# EasyEDA Pro project Led strip project Schematic &PCB.eprj, board PCB8
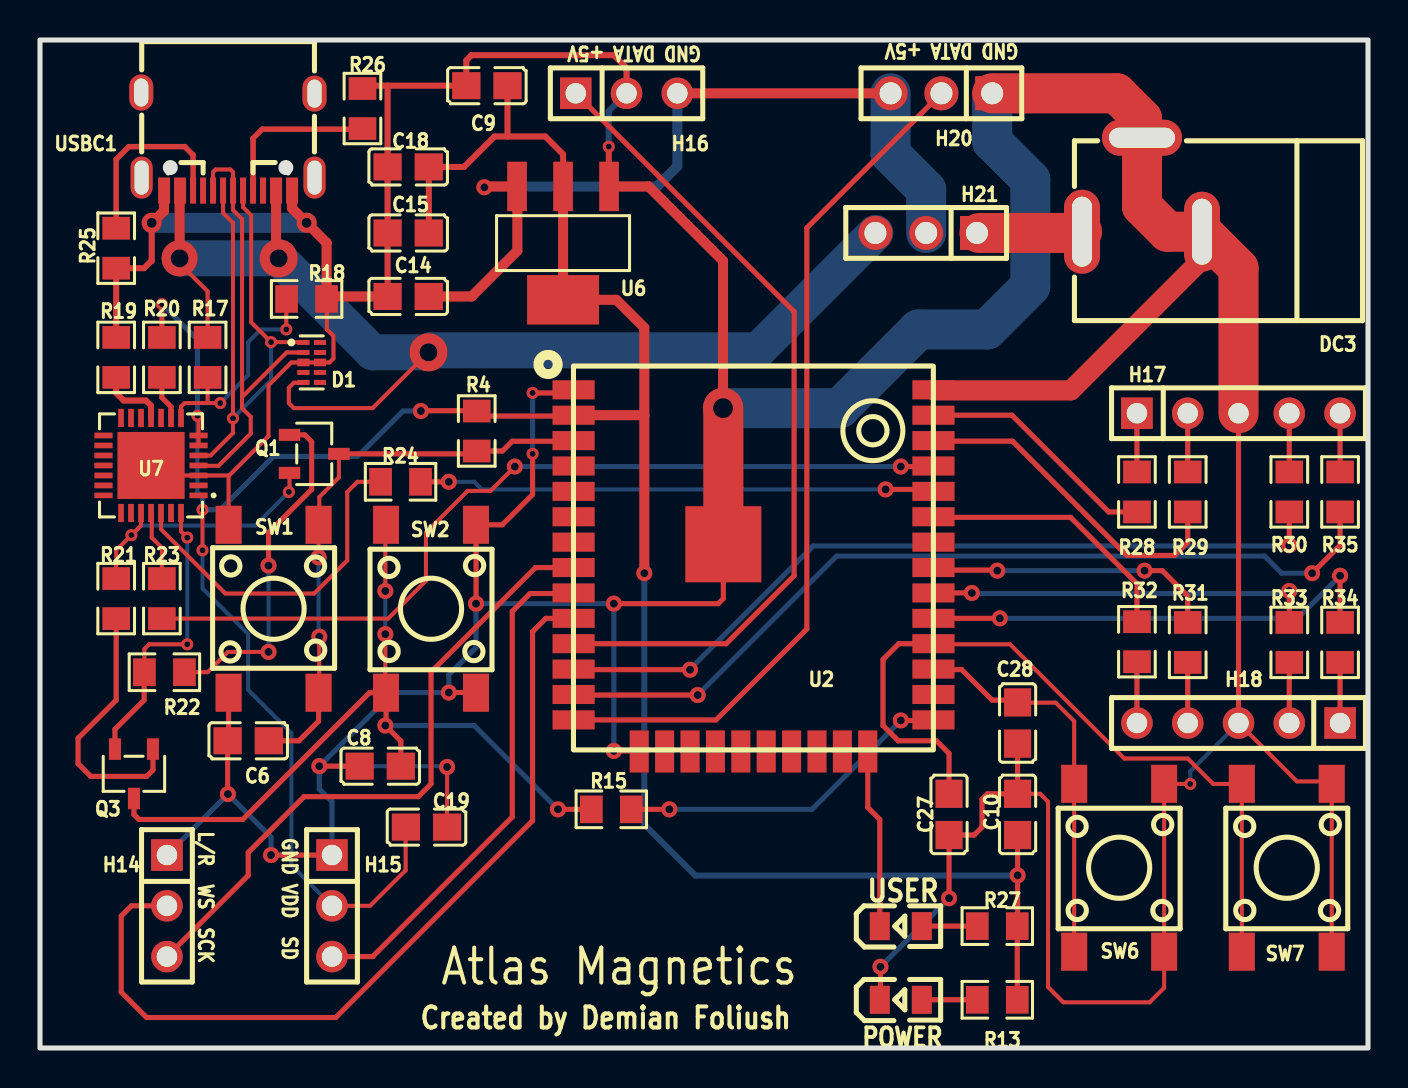
[diagram p4: board, top side]
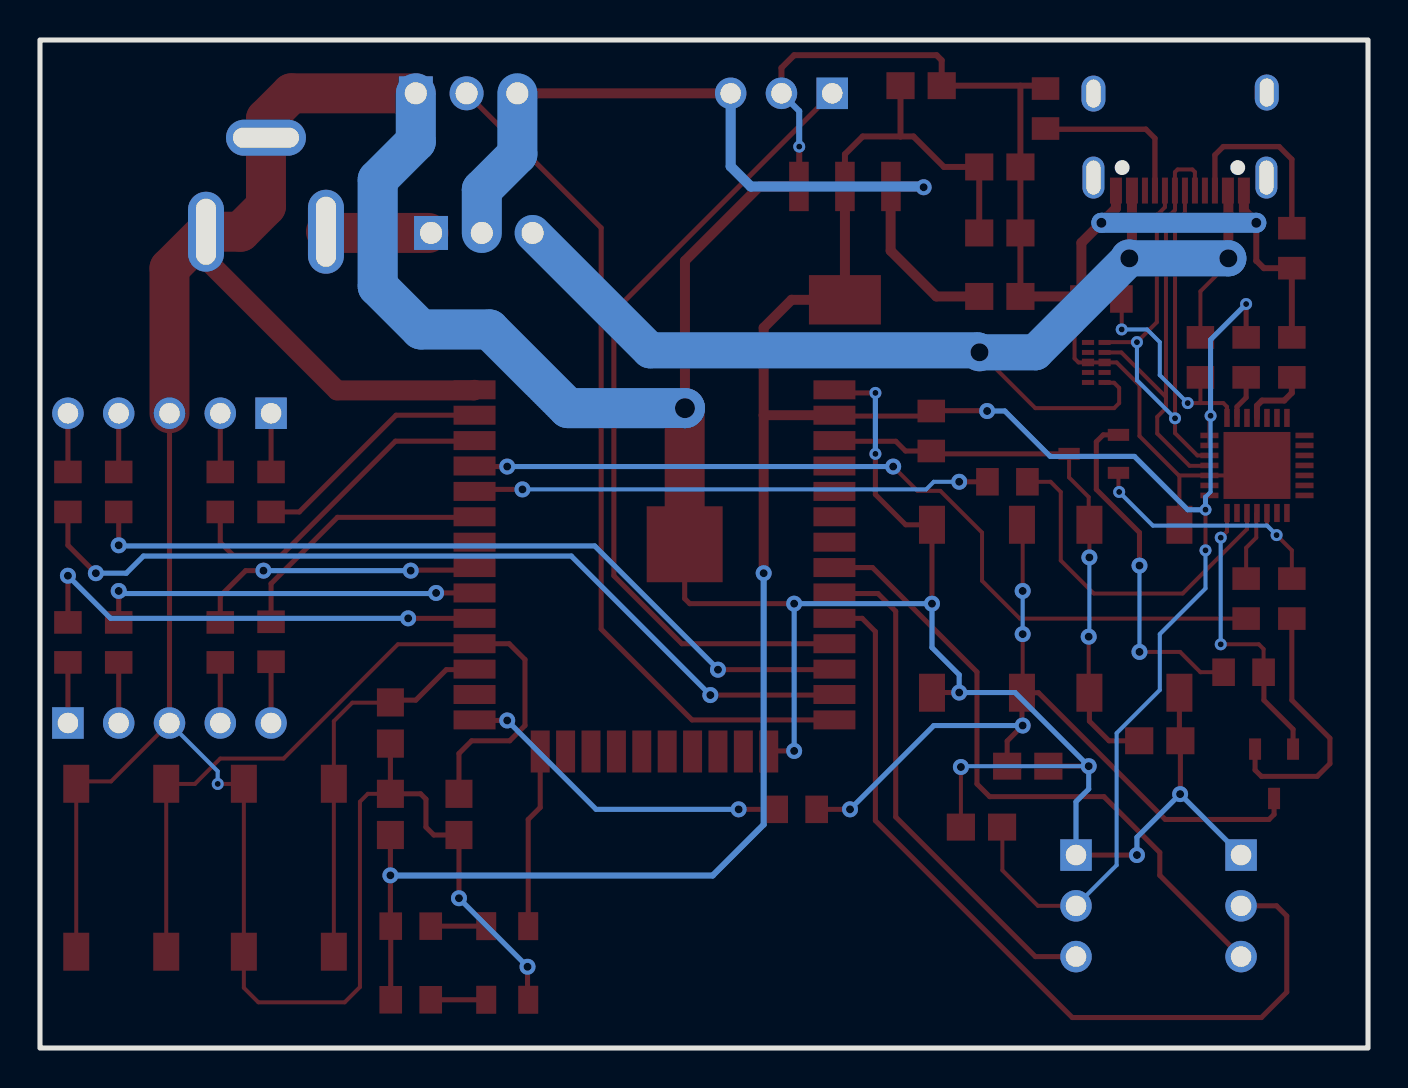
[diagram p5: board, bottom side, seen from below]

Outline 66.42 x 50.42 mm; copper layers: Top Layer, Bottom Layer. Coordinates in mm from the lower left corner of the outline.
Outline path: rectangle 0,50.42 66.42,0
Stack: Top Layer 0.035mm / Dielectric1 1.51mm FR4 er 4.5 / Bottom Layer 0.035mm

## Design rules (mm)
template: Custom Config
spacing copperThickness1oz (default): track to track 0.254, other pairs 0.124 to 0.3
spacing copperThickness2oz: track to track 0.203, other pairs 0.152 to 0.3
track width copperThickness1oz (default): min 0.127, default 0.254, max 2.54
track width copperThickness2oz: min 0.203, default 0.254, max 2.54
differential pair differentialPair (default): width min 0.127, default 0.254, max 2.54; gap min 0.152, default 0.152
via viaSize (default): diameter min 0.5, default 0.61, max 10; hole min 0.3, default 0.305, max 6.299

## Placement (name value [footprint] x y rotation side)
C6  1000nF  [C0805]  10.41 15.37 0 top
C8  100nF  [C0805]  17.02 14.1 0 top
C9  100nF  [C0805]  22.35 48.13 180 top
C10  22uF  [C0805]  48.89 11.68 270 top
C14  10uF  [C0805]  18.42 37.59 0 top
C15  10uF  [C0805]  18.42 40.77 0 top
C18  4.7uF  [C0805]  18.42 44.07 0 top
C19  100nF  [C0805]  19.33 11.05 180 top
C27  100nF  [C0805]  45.47 11.68 90 top
C28  100nF  [C0805]  48.89 16.26 90 top
D1  TPD4E02B04DQAR  [USON-10_L2.5-W1.0-P0.50-BL]  13.59 34.29 270 top
DC3  DC-005-5A-2.5  [DC-IN-TH_DC-005-5A-2.5]  55.12 43.18 180 top
H14  -  [HDR-TH_3P-P2.54-V-F]  6.35 7.11 270 top
H15  -  [HDR-TH_3P-P2.54-V-F]  14.61 7.11 270 top
H16  -  [HDR-TH_3P-P2.54-V-F]  29.34 47.75 0 top
H17  -  [HDR-TH_5P-P2.54-V-F]  59.94 31.75 0 top
H18  -  [HDR-TH_5P-P2.54-V-F]  59.94 16.26 180 top
H20  X6511WV-03H-C30D60  [HDR-TH_3P-P2.54-V-M]  45.08 47.75 180 top
H21  X6511WV-03H-C30D60  [HDR-TH_3P-P2.54-V-M]  44.32 40.77 180 top
LED3  NCD0805B2  [LED0805-R-RD]  43.05 6.1 0 top
LED6  NCD0805G1  [LED0805-R-RD]  43.05 2.41 0 top
Q1  SS8050-G  [SOT-23-3_L2.9-W1.6-P1.90-LS2.8-BR]  13.72 29.72 180 top
Q3  SS8050-G  [SOT-23-3_L2.9-W1.6-P1.90-LS2.8-BR]  4.7 13.72 90 top
R4  10kΩ  [R0805]  21.84 30.86 270 top
R13  47Ω  [R0805]  47.88 2.41 0 top
R15  22Ω  [R0805]  28.58 11.94 0 top
R17  22kΩ  [R0805]  8.38 34.54 90 top
R18  47kΩ  [R0805]  13.34 37.46 180 top
R19  10kΩ  [R0805]  3.81 34.54 270 top
R20  1kΩ  [R0805]  6.1 34.54 270 top
R21  10kΩ  [R0805]  3.81 22.48 90 top
R22  10kΩ  [R0805]  6.22 18.8 180 top
R23  0Ω  [R0805]  6.1 22.48 270 top
R24  0Ω  [R0805]  18.03 28.32 0 top
R25  5.1kΩ  [R0805]  3.81 40 270 top
R26  5.1kΩ  [R0805]  16.13 46.99 270 top
R27  47Ω  [R0805]  47.88 6.1 0 top
R28  150Ω  [R0805]  54.86 27.81 270 top
R29  150Ω  [R0805]  57.4 27.81 270 top
R30  150Ω  [R0805]  62.48 27.81 270 top
R31  150Ω  [R0805]  57.4 20.29 270 top
R32  150Ω  [R0805]  54.86 20.32 90 top
R33  150Ω  [R0805]  62.48 20.29 270 top
R34  150Ω  [R0805]  65.02 20.29 270 top
R35  150Ω  [R0805]  65.02 27.81 270 top
SW1  PTS645SH50SMTR92LFS  [KEY-SMD_4P-L6.0-W6.0-P4.50-LS9.0]  11.68 21.97 270 top
SW2  PTS645SH50SMTR92LFS  [KEY-SMD_4P-L6.0-W6.0-P4.50-LS9.0]  19.56 21.97 90 top
SW6  PTS645SH50SMTR92LFS  [KEY-SMD_4P-L6.0-W6.0-P4.50-LS9.0]  53.98 9.02 90 top
SW7  PTS645SH50SMTR92LFS  [KEY-SMD_4P-L6.0-W6.0-P4.50-LS9.0]  62.36 9.02 90 top
U2  ESP32-WROOM-32U-N4  [WIFIM-SMD_38P-L19.2-W18.0-P1.27]  35.69 23.88 90 top
U6  AMS1117-3.3  [SOT-223-4_L6.5-W3.5-P2.30-LS7.0-BR]  26.16 40.26 90 top
U7  CP2102N-A02-GQFN28R  [QFN-28_L5.0-W5.0-P0.50-TL-EP3.3]  5.55 29.14 180 top
USBC1  918-418K2023S40001  [USB-C-SMD_TYPE-C-USB-17]  9.4 45.34 180 top

## Footprints (pads in the part's own frame, mm; a bottom-side part is the same pattern mirrored in y, then rotated)
C0805
  rect 1.41x1.35 smd: 1(-1.03,0) 2(1.03,0)
DC-IN-TH_DC-005-5A-2.5
  oval 1.8x4.2 hole 1x3.5: 1(3,2.352)
  oval 1.8x4 hole 1x3.3: 2(-3,2.352)
  oval 4x1.8 hole 3.3x1: 3(-0.001,-2.352)
HDR-TH_3P-P2.54-V-F
  rect 1.575x1.575 hole 1.02: 1(-2.54,0)
  round 1.575 hole 1.02: 2(0,0) 3(2.54,0)
HDR-TH_3P-P2.54-V-M
  rect 1.7x1.7 hole 1.1: 1(-2.54,0)
  round 1.7 hole 1.1: 2(0,0) 3(2.54,0)
HDR-TH_5P-P2.54-V-F
  rect 1.575x1.575 hole 1.02: 1(-5.08,0)
  round 1.575 hole 1.02: 2(-2.54,0) 3(0,0) 4(2.54,0) 5(5.08,0)
KEY-SMD_4P-L6.0-W6.0-P4.50-LS9.0
  rect 1.9x1.3 smd: 1(-4.2,2.25) 2(4.2,2.25) 3(-4.2,-2.25) 4(4.2,-2.25)
LED0805-R-RD
  rect 1x1.399 smd: 1(1.05,0) 2(-1.05,0)
QFN-28_L5.0-W5.0-P0.50-TL-EP3.3
  rect 0.905x0.28 smd: 1(-2.377,1.5) 2(-2.377,1) 3(-2.377,0.5) 4(-2.377,0) 5(-2.377,-0.5) 6(-2.377,-1) 7(-2.377,-1.5) 15(2.377,-1.5) 16(2.377,-1) 17(2.377,-0.5) 18(2.377,0) 19(2.377,0.5) 20(2.377,1) 21(2.377,1.5)
  rect 0.28x0.905 smd: 8(-1.5,-2.377) 9(-1,-2.377) 10(-0.5,-2.377) 11(0,-2.377) 12(0.5,-2.377) 13(1,-2.377) 14(1.5,-2.377) 22(1.5,2.377) 23(1,2.377) 24(0.5,2.377) 25(0,2.377) 26(-0.5,2.377) 27(-1,2.377) 28(-1.5,2.377)
  rect 3.35x3.35 smd: 29(0,0)
R0805
  rect 1.133x1.377 smd: 1(-1,0) 2(1,0)
SOT-23-3_L2.9-W1.6-P1.90-LS2.8-BR
  rect 1.07x0.6 smd: 1(1.235,-0.95) 2(1.235,0.95) 3(-1.235,0)
SOT-223-4_L6.5-W3.5-P2.30-LS7.0-BR
  rect 2.47x0.98 smd: 1(2.835,-2.3) 2(2.835,0) 3(2.835,2.3)
  rect 2.47x3.6 smd: 4(-2.835,0)
USB-C-SMD_TYPE-C-USB-17
  oval 1.1x2.1 hole 0.7x1.7: 0(-4.334,1.802) 0(4.316,1.802)
  oval 1.2x1.8 hole 0.7x1.4: 0(-4.334,-2.398) 0(4.334,-2.453)
  rect 0.6x1.3 smd: A1(-3.209,2.451) A4(-2.409,2.451) A9(2.391,2.452) A12(3.191,2.451)
  rect 0.3x1.3 smd: A5(-1.259,2.451) A6(-0.259,2.451) A7(0.241,2.451) A8(1.24,2.453) B5(1.741,2.451) B6(0.741,2.451) B7(-0.759,2.451) B8(-1.759,2.453)
USON-10_L2.5-W1.0-P0.50-BL
  rect 0.25x0.609 smd: 1(-1,-0.414) 2(-0.5,-0.414) 4(0.5,-0.414) 5(1,-0.414) 6(1,0.414) 7(0.5,0.414) 9(-0.5,0.414) 10(-1,0.414)
  rect 0.38x0.609 smd: 3(0,-0.414) 8(0,0.414)
WIFIM-SMD_38P-L19.2-W18.0-P1.27
  rect 0.95x2.1 smd: 1(9.045,9) 2(7.775,9) 3(6.505,9) 4(5.235,9) 5(3.965,9) 6(2.695,9) 7(1.425,9) 8(0.155,9) 9(-1.115,9) 10(-2.385,9) 11(-3.655,9) 12(-4.925,9) 13(-6.195,9) 14(-7.465,9) 25(-7.465,-9) 26(-6.195,-9) 27(-4.925,-9) 28(-3.655,-9) 29(-2.385,-9) 30(-1.115,-9) 31(0.155,-9) 32(1.425,-9) 33(2.695,-9) 34(3.965,-9) 35(5.235,-9) 36(6.505,-9) 37(7.775,-9) 38(9.045,-9)
  rect 2.1x0.95 smd: 15(-9.045,5.715) 16(-9.045,4.445) 17(-9.045,3.175) 18(-9.045,1.905) 19(-9.045,0.635) 20(-9.045,-0.635) 21(-9.045,-1.905) 22(-9.045,-3.175) 23(-9.045,-4.445) 24(-9.045,-5.715)
  rect 3.8x3.8 smd: 39(1.321,1.51)

## Nets
As in the schematic.

Pads without a net: D1 4 6 7 9 10; U2 32; U7 1 2 10 12 13 14 15 16 17 18 19 20 21 22 23 27; USBC1 0 A8 B8

## Via types
v1: diameter 0.8, hole 0.4, Top Layer to Bottom Layer, 38 vias
v2: diameter 0.6, hole 0.3, Top Layer to Bottom Layer, 16 vias
v3: diameter 1, hole 0.5, Top Layer to Bottom Layer, 2 vias
v4: diameter 2, hole 1, Top Layer to Bottom Layer, 1 via
v5: diameter 1.9, hole 0.9, Top Layer to Bottom Layer, 2 vias
v6: diameter 1.8, hole 0.9, Top Layer to Bottom Layer, 1 via

## Routing (per net, layer and track width the routed paths; a pad name or vN(x,y) marks a point on that pad's centre or on a via; arc(x,y) is an arc through that point)
+3V3: length 146
  Top Layer w0.2: v2(8.13,26.92) v2(8.13,24.89) ; U7.6 U7.7 7.93,31.57 v2(7.87,31.62) ; H15.2 16.51,7.11 18.29,8.89 18.29,11.03 C19.2 ; U2.2 26.89,31.65
  Top Layer w0.254: C10.2 v1(48.89,8.64) 48.89,6.11 R27.2 R13.2 ; U2.2 26.64,31.61 22.1,31.61 R4.1 21.83,31.88 19.05,31.88 ; R20.1 v2(6.1,37.21)
  Top Layer w0.3: C15.2 C18.2 21.21,44.07 22.73,45.59 23.38,45.59 ; U6.2 26.16,44.7 25.27,45.59 23.38,45.59 ; 23.38,45.59 C9.1
  Top Layer w0.5: 30.23,31.65 26.89,31.65 ; 30.23,31.65 30.23,36.03 28.83,37.42 U6.4 U6.2 ; 30.23,31.65 v1(30.23,23.75)
  Bottom Layer w0.2: 8.13,27.56 7.87,27.81 v2(7.87,31.62) ; H15.2 12.57,9.14 12.57,15.75 10.41,17.91 10.41,20.7 8.13,22.99 v2(8.13,24.89)
  Bottom Layer w0.254: v2(7.87,31.62) 7.87,35.43 v2(6.1,37.21) ; v1(19.05,31.86) 18.16,31.86 15.89,29.59 11.68,29.59 9.02,26.92 v2(8.13,26.92) 8.13,27.56
  Bottom Layer w0.3: v1(30.23,23.75) 30.23,11.18 32.77,8.63 48.89,8.63 v1(48.89,8.64)
+5V: length 42.4
  Top Layer w0.5: v1(22.23,43.05) 22.27,43.09 U6.3 23.88,43.08 23.88,39.88 21.59,37.59 C14.2 ; H20.3 H16.3
  Bottom Layer w0.5: v1(22.23,43.05) 22.26,43.09 30.87,43.09 31.88,44.1 H16.3
  Bottom Layer w2: H21.2 44.32,42.93 42.55,44.7 H20.3
+5V_EXT: length 5.2
  Top Layer w2: 46.99,40.77 52.06,40.77 DC3.1
+5V_VBUS: length 60.4
  Top Layer w0.2: v5(19.43,34.8) 16.64,32 12.7,32 12.45,32.26 12.45,33.02 12.7,33.27 13.16,33.27 D1.5 ; v6(6.98,39.5) 6.98,39.24 8.38,37.85 R17.2
  Top Layer w0.5: USBC1.A9 6.98,42.86 v6(6.98,39.5) ; USBC1.A4 11.81,39.88
  Top Layer w0.7: v5(11.94,39.5) 11.81,39.63 11.81,39.88
  Bottom Layer w1.8: v6(6.98,39.5) v5(11.94,39.5) 16.64,34.8 v5(19.43,34.8) 19.53,34.9 35.91,34.9 H21.3
GND: length 335.1
  Top Layer w0.2: v1(20.36,14.05) C19.1 ; SW7.3 SW7.4 64.49,13.33 62.86,13.33 H18.3 ; 9.46,28.64 11.43,30.61 11.43,33.15 12.57,34.29 D1.3 D1.8 14.48,34.29 14.68,34.49 14.68,35.61 14.35,35.94 14.35,37.45 14.33,37.46 ; 9.46,28.64 9.43,28.61 SW1.3 ; 9.46,28.64 U7.3 6.05,28.64 U7.29 ; C10.1 50.02,12.71 50.42,12.32 50.42,3.05 51.18,2.29 55.5,2.29 56.23,3.01 SW6.3 SW6.4 56.23,13.21 v2(57.53,13.21)
  Top Layer w0.254: v1(21.81,22.22) SW2.4 23.12,26.17 24.64,27.69 v2(24.64,29.72) ; v1(42.04,4.06) 42.04,2.45 LED6.2 ; v1(20.45,17.78) 21.8,17.78 SW2.3 ; v1(11.56,9.65) H15.1 ; U2.1 26.53,32.77 v2(24.64,32.77) ; v1(13.97,14.1) C8.1 ; U2.15 29.94,14.86 v1(28.7,14.86) ; v1(45.47,7.49) C27.1 46.72,10.65 47.12,11.05 47.12,12.45 47.39,12.71 C10.1 C28.1 ; SW1.4 9.43,15.42 C6.1 9.38,12.71 v1(9.4,12.7) ; H17.3 H18.3 ; U2.39 34.18,22.48 33.92,22.22 v1(28.7,22.22)
  Top Layer w0.3: 16,48.13 17.39,48.13 ; 17.39,48.13 C9.2 21.32,49.4 21.58,49.66 28.7,49.66 29.34,49.02 H16.2 ; 17.39,48.13 C18.1 C15.1 C14.1 ; v2(28.45,45.08) 28.45,43.11 U6.1 ; R19.1 R25.2 5.21,39 5.57,39.37 5.59,39.37 v3(5.59,41.27)
  Top Layer w0.5: v4(34.16,32) 34.16,39.37 30.44,43.09 U6.1 ; USBC1.A12 6.21,41.87 5.61,41.27 v3(5.59,41.27) ; USBC1.A1 12.61,42 13.33,41.27 v3(13.34,41.27) 14.33,40.27 14.33,37.59 C14.1
  Top Layer w0.8: v4(34.16,32) 34.18,32.02
  Top Layer w1: U2.38 44.71,32.89 51.56,32.89 58.12,39.45 DC3.2
  Top Layer w2: 47.63,47.75 53.85,47.75 55.12,46.48 DC3.3 55.12,42.1 56.39,40.83 DC3.2 59.94,39 H17.3 ; U2.39 34.18,32.02
  Bottom Layer w0.2: H18.3 57.53,13.84 v2(57.53,13.21) ; v1(13.97,14.1) 20.32,14.1
  Bottom Layer w0.254: H14.1 v1(9.4,12.7) 11.56,10.54 v1(11.56,9.65) ; v2(24.64,29.72) v2(24.64,32.77) ; v1(42.04,4.06) v1(45.47,7.49) ; H15.1 14.61,12.32 13.97,12.95 v1(13.97,14.1) 17.65,17.78 v1(20.45,17.78) 20.45,18.67 21.81,20.03 v1(21.81,22.22) v1(28.7,22.22) v1(28.7,14.86)
  Bottom Layer w0.3: v2(28.45,45.08) 28.45,46.86 H16.2
  Bottom Layer w1: v3(5.59,41.27) v3(13.34,41.27)
  Bottom Layer w2: 47.63,47.75 47.63,45.34 49.53,43.43 49.53,38.1 47.37,35.94 43.94,35.94 40.01,32 v4(34.16,32)
DTR: length 14.6
  Top Layer w0.2: U7.28 7.05,25.84 v2(7.37,25.53) ; v2(7.37,20.19) 5.46,20.19 5.22,19.95 R22.2
  Top Layer w0.254: Q3.2 3.75,15.94 5.21,17.4 5.21,18.78 R22.2
  Bottom Layer w0.2: v2(7.37,20.19) v2(7.37,25.53)
EN: length 28.8
  Top Layer w0.2: Q1.3 14.95,28.54 13.97,27.56 13.97,26.21 SW1.1 13.93,24.51 ; v1(13.97,20.57) 13.97,17.81 SW1.2
  Top Layer w0.254: Q1.3 21.7,29.72 R4.2 23.13,29.86 23.62,30.35 26.65,30.35 U2.3 ; C6.2 12.95,15.37 13.93,16.35 SW1.2
  Bottom Layer w0.2: v1(13.97,20.57) 13.94,20.61 v1(13.94,24.54)
IO0: length 16.9
  Top Layer w0.254: R15.2 31.37,11.94 ; U2.25 44.66,16.38 v1(43.05,16.38)
  Bottom Layer w0.254: v1(31.48,11.94) 38.61,11.94 v1(43.05,16.38)
IO0_BTN: length 40.6
  Top Layer w0.2: SW2.2 17.27,26.13 v1(17.27,22.86) ; SW2.1 17.27,17.81 v1(17.27,20.7)
  Top Layer w0.254: R15.1 v1(25.91,11.94) ; v1(17.27,16.13) 18.05,15.35 C8.2 ; 17.28,16.14 17.31,16.16 SW2.1 16.48,17.77 10.14,11.43 4.95,11.43 4.7,11.68 Q3.3
  Bottom Layer w0.2: v1(17.27,20.7) v1(17.27,22.86)
  Bottom Layer w0.254: v1(17.27,16.13) 21.72,16.13 v1(25.91,11.94)
IO2: length 9
  Top Layer w0.254: U2.24 41.4,12.03 42,11.43 LED3.2
IO5: length 23.6
  Top Layer w0.254: U2.29 v1(48.01,21.49) ; R34.1 v1(65.02,23.62)
  Bottom Layer w0.254: v1(65.02,23.62) 62.89,21.49 v1(48.01,21.49)
IO12: length 43.1
  Top Layer w0.254: H20.2 38.35,41.02 38.35,20.95 33.81,16.41 U2.14
IO14: length 43.8
  Top Layer w0.254: v1(32.89,17.65) 26.71,17.65 U2.13 ; v1(63.63,23.75) 65.02,25.15 R35.2
  Bottom Layer w0.254: v1(63.63,23.75) 62.1,23.75 61.25,24.61 39.85,24.61 v1(32.89,17.65)
IO16: length 19.6
  Top Layer w0.2: 48.91,17.27 50.8,17.27 51.73,16.35 SW6.2 SW6.1
  Top Layer w0.254: U2.27 44.71,18.92 46.1,18.92 47.63,17.4 48.78,17.4 C28.2
IO17: length 38.8
  Top Layer w0.2: U2.28 44.71,20.19 48.52,20.19 54.24,14.48 57.4,14.48 58.67,13.21 60.1,13.21 SW7.2 SW7.1
  Top Layer w0.254: U2.28 42.95,20.22 42.16,19.43 42.16,16.13 42.93,15.37 44.83,15.37 45.47,14.73 C27.2
IO18: length 19.4
  Top Layer w0.254: U2.30 v1(46.61,22.76) ; v1(62.48,22.86) R33.1
  Bottom Layer w0.254: v1(62.48,22.86) 62.36,22.73 46.64,22.73 v1(46.61,22.76)
IO19: length 14.6
  Top Layer w0.254: R31.1 57.4,22.61 56.13,23.88 v1(55.24,23.88) ; U2.31 44.81,23.9 47.85,23.9 v1(47.88,23.88)
  Bottom Layer w0.254: v1(47.88,23.88) v1(55.24,23.88)
IO21: length 13.5
  Top Layer w0.254: R32.2 54.86,23.22 51.55,26.54 44.71,26.54 44.69,26.57
IO22: length 16.9
  Top Layer w0.254: R29.2 57.4,25.29 56.75,24.64 54.36,24.64 48.64,30.35 44.71,30.35 U2.36
IO23: length 12.2
  Top Layer w0.254: R28.2 53.45,26.81 48.61,31.65 U2.37
IO25: length 43.3
  Top Layer w0.254: H14.2 4.57,7.11 4.06,6.6 4.06,2.79 5.33,1.52 14.79,1.52 24.64,11.37 24.64,20.83 25.3,21.49 U2.10
IO26: length 41.1
  Top Layer w0.254: H16.1 37.72,36.83 37.72,23.62 34.32,20.22 U2.11
IO27: length 40.1
  Top Layer w0.254: v1(32.51,18.92) 26.71,18.92 U2.12 ; v1(62.48,25.15) R30.2
  Bottom Layer w0.254: v1(62.48,25.15) 62.45,25.11 38.67,25.11 32.51,18.95 v1(32.51,18.92)
IO32: length 32.3
  Top Layer w0.254: U2.8 24.78,24.03 19.56,18.81 19.56,13.21 18.92,12.57 13.21,12.57 10.41,9.78 10.41,8.64 H14.3
IO33: length 25.6
  Top Layer w0.254: U2.9 26.66,22.73 24.51,22.73 23.62,21.84 23.62,11.56 16.64,4.57 H15.3
RTS: length 13.5
  Top Layer w0.2: R21.2 3.81,24.89 v2(4.57,25.65) 5.05,26.14 U7.24 ; 12.48,28.77 12.48,27.85 v2(12.45,27.81)
  Bottom Layer w0.2: v2(4.57,25.65) 5.05,26.13 10.76,26.13 v2(12.45,27.81)
RXD: length 3.5
  Top Layer w0.2: U7.25 5.59,26.73 5.59,25.53 6.1,25.02 R23.1
RXD0: length 25.9
  Top Layer w0.254: v1(20.45,28.32) R24.2 ; U2.34 44.59,27.94 v1(42.29,27.94)
  Bottom Layer w0.2: v1(42.29,27.94) 22.1,27.94 21.72,28.32 v1(20.45,28.32)
TXD: length 17.4
  Top Layer w0.2: R24.1 15.88,28.32 15.37,27.81 15.37,24.38 13.72,22.73 9.27,22.73 6.05,25.95 U7.26
TXD0: length 43.2
  Top Layer w0.2: v1(23.75,29.08) 22.53,27.87 21.39,27.87 19.3,25.78 19.3,23.37 17.42,21.48 R23.2
  Top Layer w0.254: U2.35 44.66,29.08 v1(43.05,29.08)
  Bottom Layer w0.254: v1(23.75,29.08) v1(43.05,29.08)
USB_DN: length 28.9
  Top Layer w0.2: USBC1.B7 10.16,42.06 10.56,41.65 10.56,36.3 v2(11.56,35.31) 13.16,35.31 D1.1 ; USBC1.A7 9.16,41.77 9.65,41.27 v2(9.65,31.5) 9.65,30.76 8.53,29.64 U7.5
  Bottom Layer w0.2: v2(9.65,31.5) 11.56,33.4 v2(11.56,35.31)
USB_DP: length 22.8
  Top Layer w0.2: D1.2 12.34,34.79 10.11,32.56 ; USBC1.B6 8.66,43.81 8.78,43.94 9.53,43.94 9.66,43.81 USBC1.A6 9.65,42.88 9.65,41.92 10.11,41.46 10.11,32.56 ; 10.11,32.56 10.11,32 10.54,31.57 10.54,30.73 8.93,29.12 7.95,29.12 U7.4
$1N2629: length 2.8
  Top Layer w0.254: LED3.1 R27.1
$1N2641: length 11.2
  Top Layer w0.2: R18.2 12.32,37.45 v2(12.32,35.94) ; 8.38,32.26 R17.1 ; 8.38,32.26 7.24,32.26 7.05,32.07 U7.8 ; 8.38,32.26 v2(9.02,32.26)
  Bottom Layer w0.2: v2(9.02,32.26) 10.41,33.65 10.41,35.31 11.05,35.94 v2(12.32,35.94)
$1N2643: length 3.4
  Top Layer w0.3: R19.2 3.81,32.77 4.19,32.38 5.3,32.38 5.55,32.13 U7.11
$1N2645: length 2.2
  Top Layer w0.254: U7.9 6.55,32.08 6.1,32.53 R20.2
$1N2662: length 17.3
  Top Layer w0.2: R22.1 8.38,18.8 9.4,19.81 v1(11.43,19.81)
  Top Layer w0.254: v1(11.43,24.13) 11.43,25.78 13.59,27.94 13.59,30.32 13.24,30.67 12.48,30.67
  Bottom Layer w0.2: v1(11.43,24.13) v1(11.43,19.81)
$1N2663: length 13.2
  Top Layer w0.254: R21.1 3.81,17.4 1.91,15.49 1.91,14.22 2.54,13.59 5.33,13.59 5.65,13.9 Q3.1
$1N2715: length 9.5
  Top Layer w0.27: R25.1 3.81,44.45 4.45,45.08 7.24,45.08 7.66,44.67 USBC1.B5
$1N2716: length 8.3
  Top Layer w0.27: R26.2 16.09,45.96 11.11,45.96 10.66,45.5 USBC1.A5
$1N2724: length 2.8
  Top Layer w0.254: LED6.1 R13.1
$1N2725: length 2.9
  Top Layer w0.254: R28.1 H17.1
$1N2728: length 2.9
  Top Layer w0.254: R29.1 H17.2
$1N2733: length 3.1
  Top Layer w0.254: R32.1 H18.5
$1N2736: length 3
  Top Layer w0.254: R31.2 H18.4
$1N2738: length 2.9
  Top Layer w0.254: R30.1 H17.4
$1N2741: length 2.9
  Top Layer w0.254: R35.1 H17.5
$1N2746: length 3
  Top Layer w0.254: R33.2 H18.2
$1N2749: length 3
  Top Layer w0.254: R34.2 H18.1

## Text on the board
Top Silkscreen Layer: GND DATA +5V | L/R  WS  SCK | GND VDD  SD | POWER | Created by Demian Foliush | USER | Atlas Magnetics
